# EAGLE schematic ver1.0 (EAGLE 7.1.0)
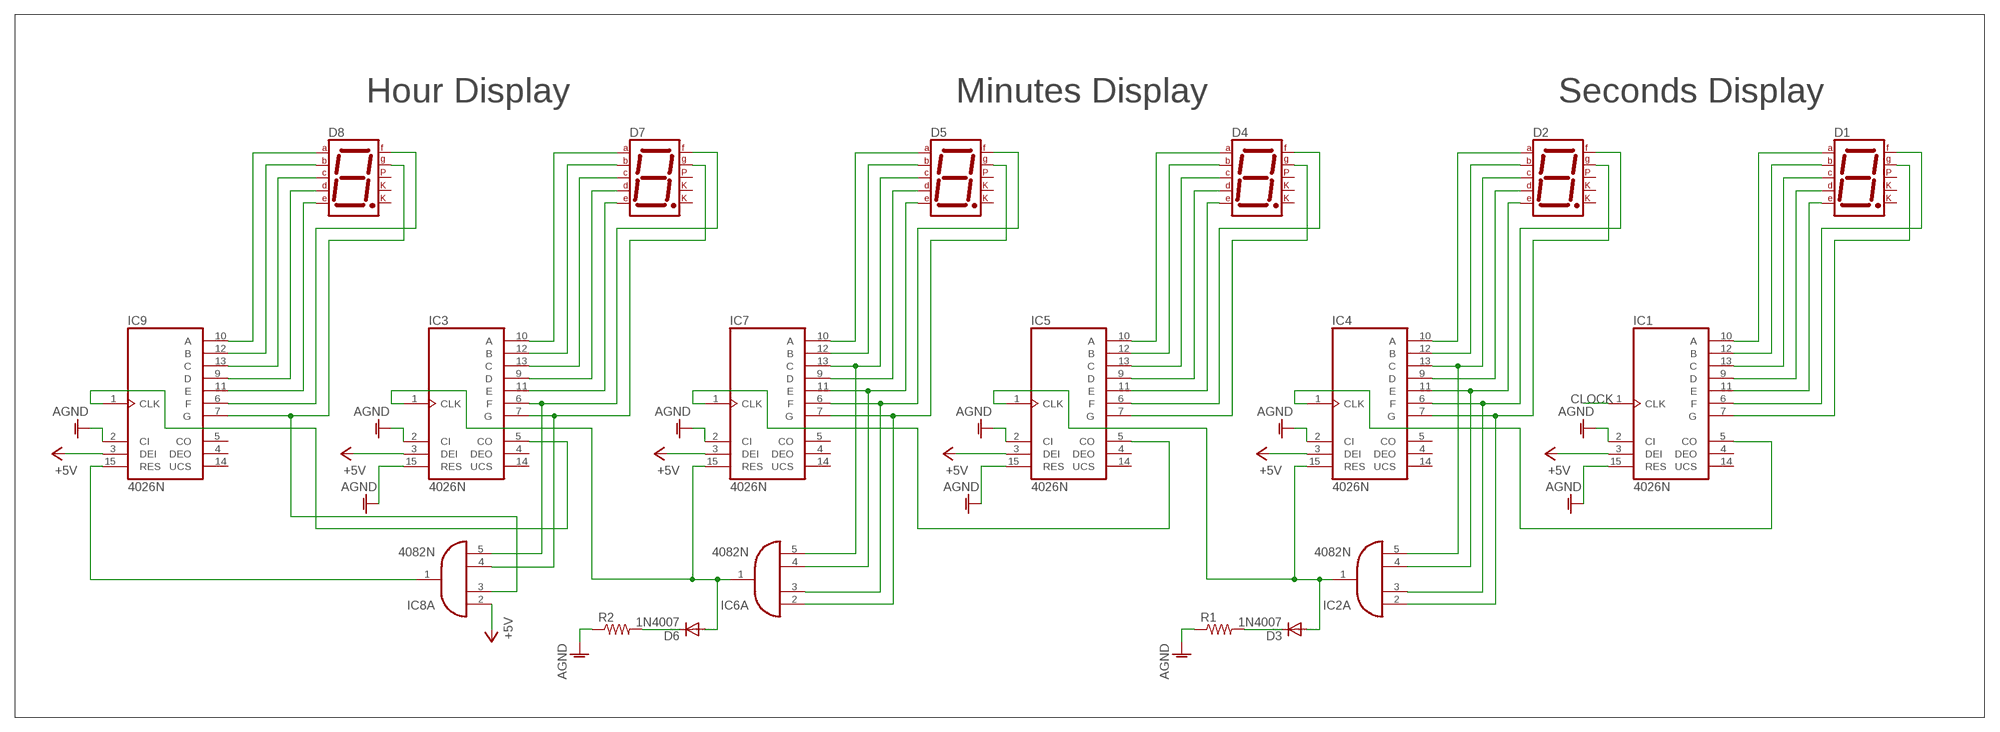
[diagram p0: schematic, sheet 1]

## Parts
D1  7SEG-CK  [7SEG-13]
D2  7SEG-CK  [7SEG-13]
D3  1N4007  1N4004  [DO41-10]
D4  7SEG-CK  [7SEG-13]
D5  7SEG-CK  [7SEG-13]
D6  1N4007  1N4004  [DO41-10]
D7  7SEG-CK  [7SEG-13]
D8  7SEG-CK  [7SEG-13]
IC1  4026N  [DIL16]
IC2  4082N  [DIL14]
IC3  4026N  [DIL16]
IC4  4026N  [DIL16]
IC5  4026N  [DIL16]
IC6  4082N  [DIL14]
IC7  4026N  [DIL16]
IC8  4082N  [DIL14]
IC9  4026N  [DIL16]
R1  R-US_0204/2V  [0204V]
R2  R-US_0204/2V  [0204V]

## Nets
+5V: IC1.3(DEI) IC3.3(DEI) IC4.3(DEI) IC5.3(DEI) IC7.3(DEI) IC8.2(A:I0) IC9.3(DEI)
AGND: IC1.2(CI) IC1.15(RES) IC3.2(CI) IC3.15(RES) IC4.2(CI) IC5.2(CI) IC5.15(RES) IC7.2(CI) IC9.2(CI) R1.1 R2.1
CLOCK: IC1.1(CLK)
N$1: D1.7(A) IC1.10(A)
N$2: D1.6(B) IC1.12(B)
N$3: D1.4(C) IC1.13(C)
N$4: D1.2(D) IC1.9(D)
N$5: D1.1(E) IC1.11(E)
N$6: D1.9(F) IC1.6(F)
N$7: D1.10(G) IC1.7(G)
N$8: D2.7(A) IC4.10(A)
N$9: D2.6(B) IC4.12(B)
N$10: D2.4(C) IC2.5(A:I3) IC4.13(C)
N$11: D2.2(D) IC4.9(D)
N$12: D2.1(E) IC2.4(A:I2) IC4.11(E)
N$13: D2.9(F) IC2.3(A:I1) IC4.6(F)
N$14: D2.10(G) IC2.2(A:I0) IC4.7(G)
N$15: IC1.5(CO) IC4.1(CLK)
N$16: D3.C R1.2
N$17: D3.A IC2.1(A:O) IC4.15(RES) IC5.1(CLK)
N$18: D7.7(A) IC3.10(A)
N$19: D4.7(A) IC5.10(A)
N$20: D4.6(B) IC5.12(B)
N$21: D4.4(C) IC5.13(C)
N$22: D4.2(D) IC5.9(D)
N$23: D4.1(E) IC5.11(E)
N$24: D4.9(F) IC5.6(F)
N$25: D4.10(G) IC5.7(G)
N$26: D5.7(A) IC7.10(A)
N$27: D5.6(B) IC7.12(B)
N$28: D5.4(C) IC6.5(A:I3) IC7.13(C)
N$29: D5.2(D) IC7.9(D)
N$30: D5.1(E) IC6.4(A:I2) IC7.11(E)
N$31: D5.9(F) IC6.3(A:I1) IC7.6(F)
N$32: D5.10(G) IC6.2(A:I0) IC7.7(G)
N$33: IC5.5(CO) IC7.1(CLK)
N$34: D6.A IC3.1(CLK) IC6.1(A:O) IC7.15(RES)
N$35: D6.C R2.2
N$36: D7.6(B) IC3.12(B)
N$37: D7.4(C) IC3.13(C)
N$38: D7.2(D) IC3.9(D)
N$39: D7.1(E) IC3.11(E)
N$40: D7.9(F) D7.10(G) IC3.6(F) IC3.7(G) IC8.4(A:I2) IC8.5(A:I3)
N$42: D8.7(A) IC9.10(A)
N$43: D8.6(B) IC9.12(B)
N$44: D8.4(C) IC9.13(C)
N$45: D8.2(D) IC9.9(D)
N$46: D8.1(E) IC9.11(E)
N$47: D8.9(F) IC9.6(F)
N$48: D8.10(G) IC8.3(A:I1) IC9.7(G)
N$49: IC3.5(CO) IC9.1(CLK)
N$50: IC8.1(A:O) IC9.15(RES)
Unconnected: D1.3(CK1) D1.5(DP) D1.8(CK2) D2.3(CK1) D2.5(DP) D2.8(CK2) D4.3(CK1) D4.5(DP) D4.8(CK2) D5.3(CK1) D5.5(DP) D5.8(CK2) D7.3(CK1) D7.5(DP) D7.8(CK2) D8.3(CK1) D8.5(DP) D8.8(CK2) IC1.4(DEO) IC1.14(UCS) IC2.9(B:I0) IC2.10(B:I1) IC2.11(B:I2) IC2.12(B:I3) IC2.13(B:O) IC3.4(DEO) IC3.14(UCS) IC4.4(DEO) IC4.5(CO) IC4.14(UCS) IC5.4(DEO) IC5.14(UCS) IC6.9(B:I0) IC6.10(B:I1) IC6.11(B:I2) IC6.12(B:I3) IC6.13(B:O) IC7.4(DEO) IC7.5(CO) IC7.14(UCS) IC8.9(B:I0) IC8.10(B:I1) IC8.11(B:I2) IC8.12(B:I3) IC8.13(B:O) IC9.4(DEO) IC9.5(CO) IC9.14(UCS)

## Notes on the sheet
- Hour Display | Minutes Display | Seconds Display

## Power pins joined to a net without a drawn wire
VDD: IC1.16(VDD) IC2.14(P:VDD) IC3.16(VDD) IC4.16(VDD) IC5.16(VDD) IC6.14(P:VDD) IC7.16(VDD) IC8.14(P:VDD) IC9.16(VDD)
VSS: IC1.8(VSS) IC2.7(P:VSS) IC3.8(VSS) IC4.8(VSS) IC5.8(VSS) IC6.7(P:VSS) IC7.8(VSS) IC8.7(P:VSS) IC9.8(VSS)

## Library data of the parts
D1 D2 D4 D5 D7 D8 = special:7SEG-CK: 7-segment DISPLAY single cathode, 13 mm
D3 D6 = diode:1N4004: DIODE general purpose rectifier, 1 A
IC1 IC3-IC5 IC7 IC9 = 40xx:4026: Decade COUNTER/DIVIDER, 7-seg. outputs
IC2 IC6 IC8 = 40xx:4082: Dual 4-input AND
R1 R2 = resistor:R-US_: RESISTOR, American symbol